# EAGLE design atmega8 (EAGLE 8.0.1)
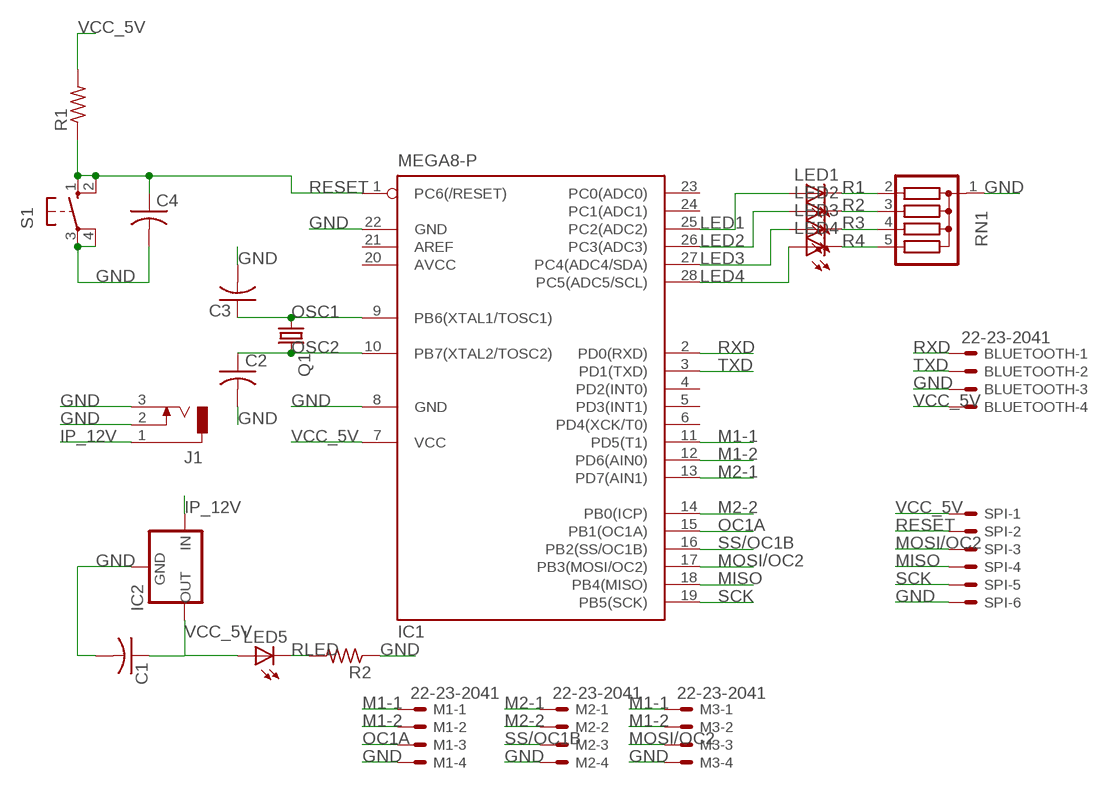
[diagram p0: schematic, sheet 1]

## Parts
BLUETOOTH  22-23-2041  [22-23-2041]
C1  C-US050-025X075  [C050-025X075]
C2  C-US050-025X075  [C050-025X075]
C3  C-US050-025X075  [C050-025X075]
C4  C-US050-025X075  [C050-025X075]
IC1  MEGA8-P  [DIL28-3]
IC2  78XXL  [78XXL]
J1  DCJ0303  [DCJ0303]
LED1  LED3MM  [LED3MM]
LED2  LED3MM  [LED3MM]
LED3  LED3MM  [LED3MM]
LED4  LED3MM  [LED3MM]
LED5  LED3MM  [LED3MM]
M1  22-23-2041  [22-23-2041]
M2  22-23-2041  [22-23-2041]
M3  22-23-2041  [22-23-2041]
Q1  CRYSTALHC18U-V  [HC18U-V]
R1  R-US_0204/7  [0204/7]
R2  R-US_0204/7  [0204/7]
RN1  G04R  [SIL5]
S1  10-XX  [B3F-10XX]
SPI  22-23-2061  [22-23-2061]

## Nets
GND: BLUETOOTH.3 C1.2 C2.2 C3.2 C4.2 IC1.8(GND) IC1.22(GND) IC2.GND J1.2 J1.3 M1.4 M2.4 M3.4 R2.1 RN1.1 S1.3(P) S1.4(P1) SPI.6
IP_12V: IC2.IN J1.1
LED1: IC1.25(PC2(ADC2)) LED1.A
LED2: IC1.26(PC3(ADC3)) LED2.A
LED3: IC1.27(PC4(ADC4/SDA)) LED3.A
LED4: IC1.28(PC5(ADC5/SCL)) LED4.A
M1-1: IC1.11(PD5(T1)) M1.1 M3.1
M1-2: IC1.12(PD6(AIN0)) M1.2 M3.2
M2-1: IC1.13(PD7(AIN1)) M2.1
M2-2: IC1.14(PB0(ICP)) M2.2
MISO: IC1.18(PB4(MISO)) SPI.4
MOSI/OC2: IC1.17(PB3(MOSI/OC2)) M3.3 SPI.3
OC1A: IC1.15(PB1(OC1A)) M1.3
OSC1: C3.1 IC1.9(PB6(XTAL1/TOSC1)) Q1.1
OSC2: C2.1 IC1.10(PB7(XTAL2/TOSC2)) Q1.2
R1: LED1.K(C) RN1.2
R2: LED2.K(C) RN1.3
R3: LED3.K(C) RN1.4
R4: LED4.K(C) RN1.5
RESET: C4.1 IC1.1(PC6(/RESET)) R1.1 S1.1(S) S1.2(S1) SPI.2
RLED: LED5.K(C) R2.2
RXD: BLUETOOTH.1 IC1.2(PD0(RXD))
SCK: IC1.19(PB5(SCK)) SPI.5
SS/OC1B: IC1.16(PB2(SS/OC1B)) M2.3
TXD: BLUETOOTH.2 IC1.3(PD1(TXD))
VCC_5V: BLUETOOTH.4 C1.1 IC1.7(VCC) IC2.OUT LED5.A R1.2 SPI.1
Unconnected: IC1.4(PD2(INT0)) IC1.5(PD3(INT1)) IC1.6(PD4(XCK/T0)) IC1.21(AREF) IC1.23(PC0(ADC0)) IC1.24(PC1(ADC1))

## Power pins joined to a net without a drawn wire
AVCC: IC1.20(AVCC)

## Library data of the parts
BLUETOOTH M1-M3 = con-molex:22-23-2041: .100" (2.54mm) Center Header - 4 Pin; MF: MOLEX; MPN: 22-23-2041; OC_FARNELL: 1462920; OC_NEWARK: 38C0355
C1-C4 = rcl:C-US: CAPACITOR, American symbol
IC1 = atmel:MEGA8-P: MICROCONTROLLER 8 Kbytes FLASH, 1 kbytes SRAM, 512 bytes EEPROM, USART, 4-channel 10 bit ADC, 2-channel 8 bit ADC Pin compatible with Atmega48, ATMega88, ATMega168 Source: avr.lbr; OC_FARNELL: unknown; OC_NEWARK: unknown
IC2 = v-reg:78XXL: VOLTAGE REGULATOR
J1 = con-jack:DCJ0303: DC POWER JACK Source: DCJ0303.pdf; OC_FARNELL: unknown; OC_NEWARK: unknown
LED1-LED5 = led:LED: LED OSRAM: - CHIPLED LG R971, LG N971, LY N971, LG Q971, LY Q971, LO R971, LY R971 LH N974, LH R974 LS Q976, LO Q976, LY Q976 LO Q996 - Hyper CHIPLED LW Q18S LB Q993, LB Q99A, LB R99A - SideLED LS A670, LO A670, LY A670, LG A670, LP A670 LB A673, LV A673, LT A673, LW A673 LH A674 LY A675 LS A676, LA A676, LO A676, LY A676, LW A676 LS A679, LY A679, LG A679 - Hyper Micro SIDELED® LS Y876, LA Y876, LO Y876, LY Y876 LT Y87S - SmartLED LW L88C, LW L88S LB L89C, LB L89S, LG L890 LS L89K, LO L89K, LY L89K LS L896, LA L896, LO L896, LY L896 - TOPLED LS T670, LO T670, LY T670, LG T670, LP T670 LSG T670, LSP T670, LSY T670, LOP T670, LYG T670 LG T671, LOG T671, LSG T671 LB T673, LV T673, LT T673, LW T673 LH T674 LS T676, LA T676, LO T676, LY T676, LB T676, LH T676, LSB T676, LW T676 LB T67C, LV T67C, LT T67C, LS T67K, LO T67K, LY T67K, LW E67C LS E67B, LA E67B, LO E67B, LY E67B, LB E67C, LV E67C, LT E67C LW T67C LS T679, LY T679, LG T679 LS T770, LO T770, LY T770, LG T770, LP T770 LB T773, LV T773, LT T773, LW T773 LH T774 LS E675, LA E675, LY E675, LS T675 LS T776, LA T776, LO T776, LY T776, LB T776 LHGB T686 LT T68C, LB T68C - Hyper Mini TOPLED® LB M676 - Mini TOPLED Santana® LG M470 LS M47K, LO M47K, LY M47K Source: http://www.osram.convergy.de LUXEON: - LUMILED® LXK2-PW12-R00, LXK2-PW12-S00, LXK2-PW14-U00, LXK2-PW14-V00 LXK2-PM12-R00, LXK2-PM12-S00, LXK2-PM14-U00 LXK2-PE12-Q00, LXK2-PE12-R00, LXK2-PE12-S00, LXK2-PE14-T00, LXK2-PE14-U00 LXK2-PB12-K00, LXK2-PB12-L00, LXK2-PB12-M00, LXK2-PB14-N00, LXK2-PB14-P00, LXK2-PB14-Q00 LXK2-PR12-L00, LXK2-PR12-M00, LXK2-PR14-Q00, LXK2-PR14-R00 LXK2-PD12-Q00, LXK2-PD12-R00, LXK2-PD12-S00 LXK2-PH12-R00, LXK2-PH12-S00 LXK2-PL12-P00, LXK2-PL12-Q00, LXK2-PL12-R00 Source: www.luxeon.com KINGBRIGHT: KA-3528ASYC Source: www.kingbright.com
Q1 = crystal:CRYSTAL: CRYSTAL; OC_FARNELL: unknown; OC_NEWARK: unknown
R1 R2 = rcl:R-US_: RESISTOR, American symbol
RN1 = resistor-sil:G04R: SIL RESISTOR; OC_FARNELL: unknown; OC_NEWARK: unknown
S1 = switch-omron:10-XX: OMRON SWITCH; MPN: B3F-1000; OC_FARNELL: 176432; OC_NEWARK: 36M3542
SPI = con-molex:22-23-2061: .100" (2.54mm) Center Header - 6 Pin; MF: MOLEX; MPN: 22-23-2061; OC_FARNELL: 1462922; OC_NEWARK: 27C1933

## Board
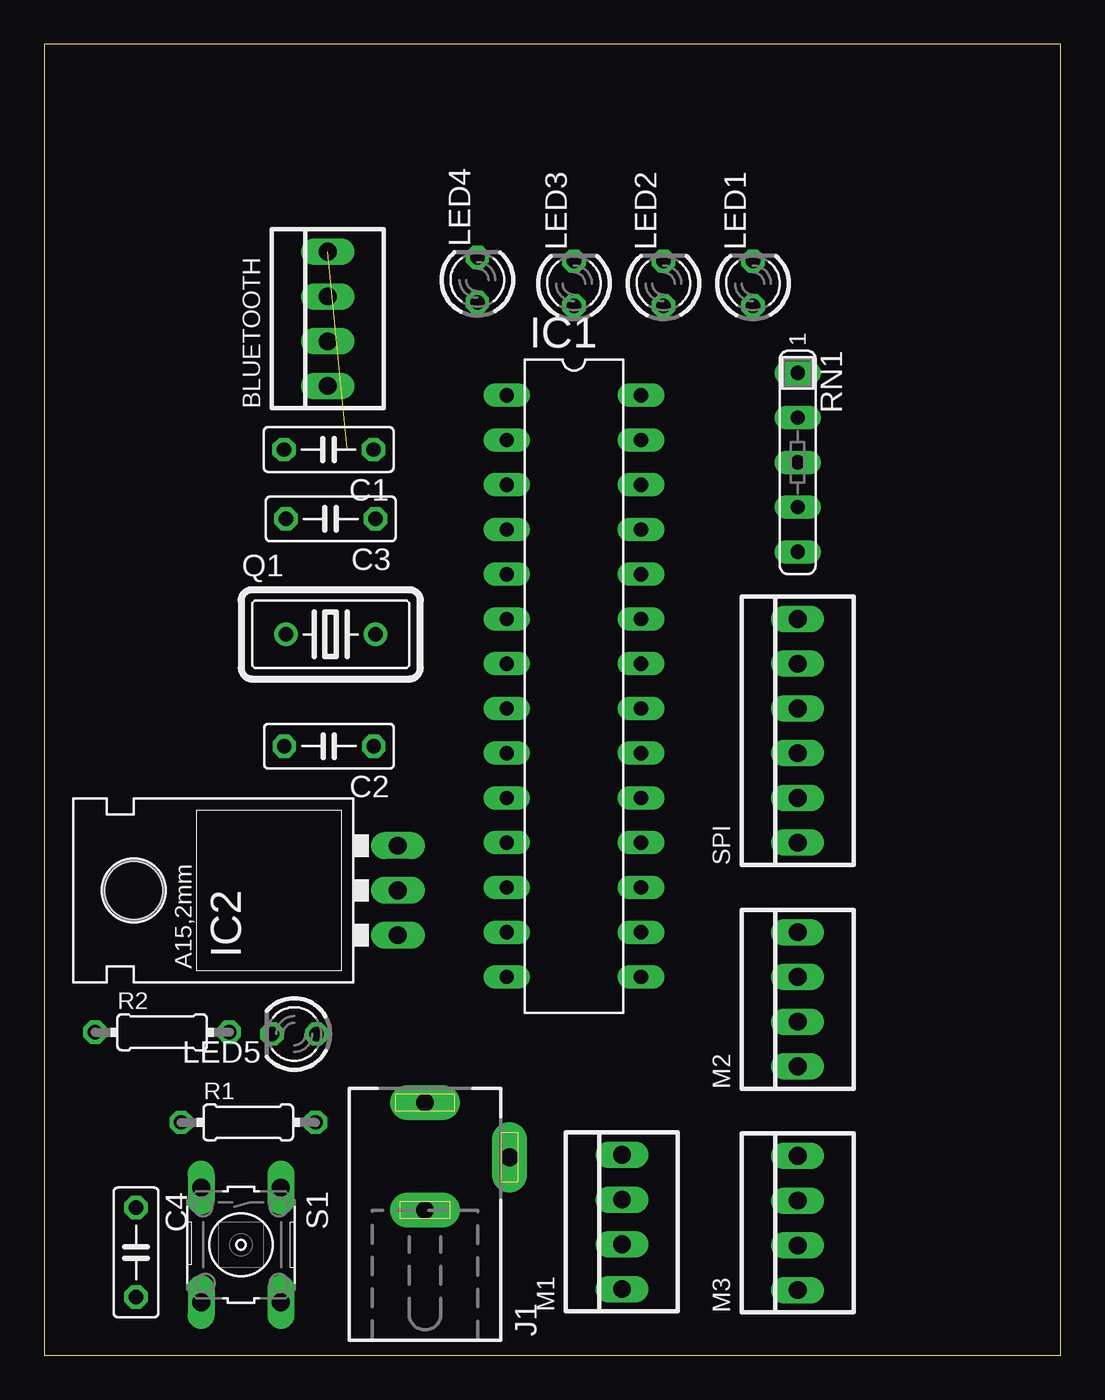
[diagram p1: board, top side]
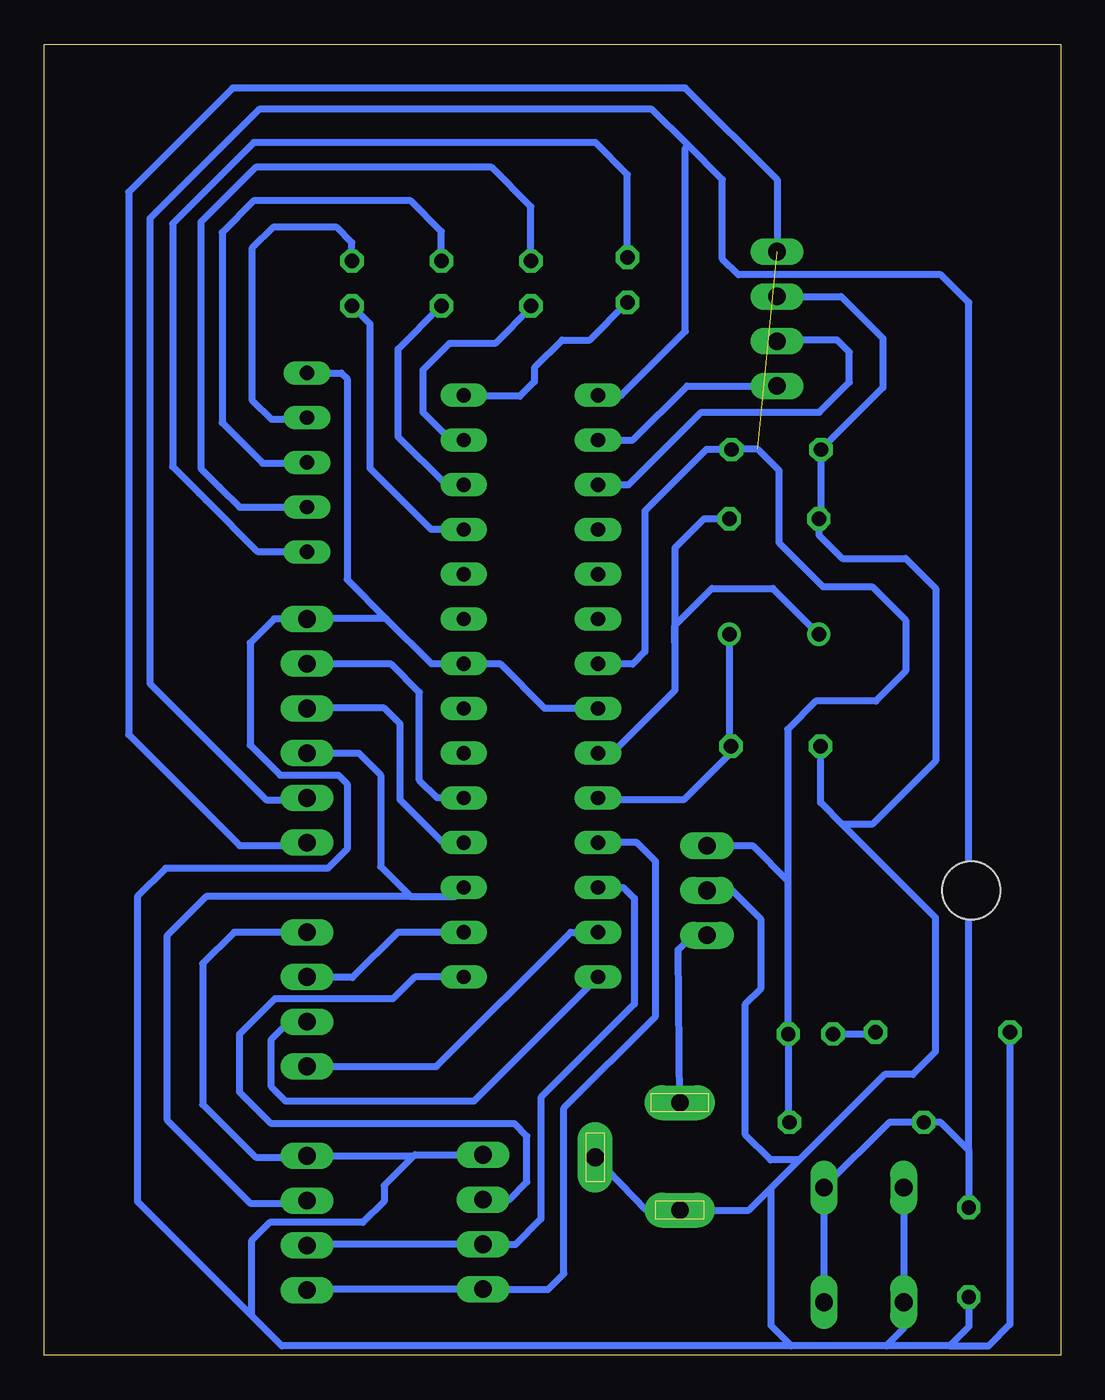
[diagram p2: board, bottom side, seen from below]

Size 57.7 x 74.45 mm. Coordinates in mm from the lower left corner, seen from the top.
Outline: 0,0 57.7,0 57.7,74.45 0,74.45 0,0
Copper layers (1*16): Top 0.035mm / dielectric 1.5mm / Bottom 0.035mm
Design rules "default": minimum track width 10mil, minimum drill 24mil, track to track 8mil, track to pad 8mil, pad to pad 8mil, via to via 8mil, smd to smd 8mil, copper to edge 40mil, drill to drill 8mil, minimum pad ring 10mil, minimum via ring 8mil, stop-mask expansion 4mil, vias tented up to drill 0mil, thermal gap 10mil

### Footprints (pad centres in the part's own frame; a part is rotated, then mirrored left to right if it is on the bottom)
22-23-2041 = drill 1 long: 1 -3.81,0; 2 -1.27,0; 3 1.27,0; 4 3.81,0
C050-025X075 = drill 0.813 octagon: 1 -2.54,0; 2 2.54,0
DIL28-3 = drill 0.813 long: 1 -16.51,-3.81; 2 -13.97,-3.81; 3 -11.43,-3.81; 4 -8.89,-3.81; 5 -6.35,-3.81; 6 -3.81,-3.81; 7 -1.27,-3.81; 8 1.27,-3.81; 9 3.81,-3.81; 10 6.35,-3.81; 11 8.89,-3.81; 12 11.43,-3.81; 13 13.97,-3.81; 14 16.51,-3.81; 15 16.51,3.81; 16 13.97,3.81; 17 11.43,3.81; 18 8.89,3.81; 19 6.35,3.81; 20 3.81,3.81; 21 1.27,3.81; 22 -1.27,3.81; 23 -3.81,3.81; 24 -6.35,3.81; 25 -8.89,3.81; 26 -11.43,3.81; 27 -13.97,3.81; 28 -16.51,3.81
78XXL = drill 1.016 long: GND 0,-3.81; IN -2.54,-3.81; OUT 2.54,-3.81 | hole 3.302: 0,11.176
DCJ0303 = drill 1 pad 2 long: 1 0,3.1; 2 4.8,0; 3 0,-3
LED3MM = drill 0.813 octagon: A -1.27,0; K 1.27,0
HC18U-V = drill 0.813: 1 -2.54,0; 2 2.54,0
0204/7 = drill 0.813 octagon: 1 -3.81,0; 2 3.81,0
SIL5 = drill 0.813 long: 1 -5.08,0; 2 -2.54,0; 3 0,0; 4 2.54,0; 5 5.08,0
B3F-10XX = drill 1.016 long: 1 -3.251,2.261; 2 3.251,2.261; 3 -3.251,-2.261; 4 3.251,-2.261
22-23-2061 = drill 1 long: 1 -6.35,0; 2 -3.81,0; 3 -1.27,0; 4 1.27,0; 5 3.81,0; 6 6.35,0

### Placement (x,y rotation side)
BLUETOOTH  16.1,58.85 90 top
C1  16.15,51.43 180 top
C2  16.17,34.59 180 top
C3  16.27,47.49 180 top
C4  5.22,5.85 270 top
IC1  30.07,38 270 top
IC2  16.27,26.4 90 top
J1  21.62,11.25 0 top
LED1  40.23,60.86 90 top
LED2  35.15,60.86 90 top
LED3  30.07,60.86 90 top
LED4  24.59,61.06 90 top
LED5  14.2,18.25 180 top
M1  32.79,7.58 90 top
M2  42.77,20.22 90 top
M3  42.77,7.52 90 top
Q1  16.27,40.94 0 top
R1  11.59,13.23 0 top
R2  6.7,18.35 0 top
RN1  42.77,50.7 270 top
S1  11.18,6.28 270 top
SPI  42.77,35.46 90 top

### Tracks (layer width: path | path; a pad name or v marks a point on that pad's centre or on a via)
GND
  Bottom 0.406: 38.3,41.85 35.72,39.27 IC1.22 31.82,39.27 29.3,36.75 26.28,36.75 IC1.8 | 38.3,41.85 42.73,41.85 SPI.6 44.64,41.81 46,40.45 46,34.65 44.3,32.95 41,32.95 40.5,32.45 40.5,28.75 41.6,27.65 50.8,27.65 52.4,26.05 52.4,8.75 45.9,2.25 | 5.2,3.29 C4.2 | RN1.1 40.83,55.78 40.5,55.45 40.5,44.05 38.3,41.85 | BLUETOOTH.3 12.47,60.12 10.1,57.75 10.1,54.94 C1.2 13.61,47.61 C3.2 13.73,46.58 12.4,45.25 8.8,45.25 7.1,43.55 7.1,33.75 10.7,30.15 12.3,30.15 12.35,30.1 | 45.9,2.25 45.9,6.55 44.9,7.55 39.6,7.55 38.4,8.75 38.4,9.65 36.66,11.39 | 45.9,2.25 44.2,0.55 15.3,0.55 | S1.3 S1.4 | M2.4 46.92,24.03 48.7,22.25 48.7,14.25 45.7,11.25 42.85,11.25 M3.4 36.72,11.33 36.66,11.39 | C2.2 13.63,31.38 12.35,30.1 | C4.2 5.22,2.53 | S1.4 8.92,2.47 | 12.35,30.1 7.1,24.85 7.1,17.25 8.4,15.95 10,15.95 14.85,11.1 | IC2.GND 18.65,26.4 17,24.75 17,20.85 17.9,19.95 17.9,12.53 16.47,11.1 14.85,11.1 | S1.4 8.92,2.17 | 9.9,0.55 15.3,0.55 | 6.3,0.55 9.9,0.55 | 6.3,0.55 4.1,0.55 2.89,1.76 R2.1 | 15.9,1.15 16.38,1.63 | 15.9,1.15 15.3,0.55 | S1.4 8.92,1.53 9.9,0.55 | C4.2 5.22,1.63 6.3,0.55 | J1.2 23.52,8.25 J1.3 17.7,8.25 16.45,9.5 | 16.45,9.5 14.85,11.1 | 36.66,11.39 M1.4 | 16.45,9.5 16.45,1.7 15.9,1.15
IP_12V
  Bottom 0.406: IC2.IN 20.89,23.86 21.72,23.03 J1.1
LED1
  Bottom 0.406: IC1.25 35.74,46.89 39.2,50.35 39.2,58.56 LED1.A
LED2
  Bottom 0.406: IC1.26 34.88,49.43 37.6,52.15 37.6,57.14 LED2.A
LED3
  Bottom 0.406: IC1.27 34.62,51.97 36.2,53.55 36.2,55.95 34.7,57.45 32.1,57.45 30.07,59.48 LED3.A
LED4
  Bottom 0.406: LED4.A 26.73,57.65 28.3,57.65 29.87,56.08 29.87,55.28 30.7,54.45 33.82,54.45 IC1.28
M1-1
  Bottom 0.406: IC1.11 24.06,29.11 23,28.05 23,19.25 28.2,14.05 28.2,4.65 29.1,3.75 32.77,3.75 M1.1 42.71,3.77 M3.1
M1-2
  Bottom 0.406: 25.22,26.57 IC1.12 24.82,26.57 24.2,25.95 24.2,19.95 29.5,14.65 29.5,7.75 30.94,6.31 M1.2 | 32.73,6.25 M1.2 | M1.2 42.71,6.31 M3.2
M2-1
  Bottom 0.406: IC1.13 27.82,24.03 35.44,16.41 M2.1 42.61,16.25
M2-2
  Bottom 0.406: M2.2 42.97,18.75 44,18.75 44.8,17.95 44.8,15.25 44,14.45 33.3,14.45 IC1.14
MISO
  Bottom 0.406: IC1.18 35.06,29.11 37.5,31.55 37.5,35.85 38.4,36.75 42.75,36.75 SPI.4
MOSI/OC2
  Bottom 0.406: M3.3 42.91,8.65 46,8.65 50.7,13.35 50.7,23.85 48.5,26.05 36.9,26.05 | SPI.3 39.84,34.19 38.6,32.95 38.6,27.75 36.9,26.05 | 36.9,26.05 34.4,26.05 IC1.17
OC1A
  Bottom 0.406: IC1.15 36.66,21.49 37.9,20.25 44.6,20.25 46.6,18.25 46.6,14.95 44.8,13.15 31,13.15 30.3,12.45 30.3,9.85 31.3,8.85 M1.3
OSC1
  Bottom 0.406: IC1.9 25.46,34.19 21.9,37.75 21.9,40.45 | 21.9,40.45 21.9,41.45 19.8,43.55 16.34,43.55 Q1.1 | C3.1 20.26,47.49 21.9,45.85 21.9,40.45
OSC2
  Bottom 0.406: Q1.2 18.81,34.69 C2.1 18.71,34.24 21.4,31.55 26.16,31.55 IC1.10
R1
  Bottom 0.406: LED1.K 40.23,63.18 41.1,64.05 44.7,64.05 45.9,62.85 45.9,54.25 44.8,53.15 42.86,53.15 RN1.2
R2
  Bottom 0.406: LED2.K 35.15,63.8 36.9,65.55 45.8,65.55 47.6,63.75 47.6,52.95 45.3,50.65 42.82,50.65 RN1.3
R3
  Bottom 0.406: LED3.K 30.07,65.22 32.3,67.45 45.7,67.45 48.8,64.35 48.8,50.35 47.75,49.3 | RN1.4 46.6,48.15 47.75,49.3 | 47.75,49.3 48,49.55
R4
  Bottom 0.406: LED4.K 24.59,67.04 26.4,68.85 45.8,68.85 50.4,64.25 50.4,50.45 48.5,48.55 | 48.5,48.55 48.9,48.95 | 48.5,48.55 45.6,45.65 42.8,45.65 RN1.5
RESET
  Bottom 0.406: S1.1 S1.2 | IC1.1 24.94,54.51 21.3,58.15 21.3,68.55 21.15,68.7 | SPI.2 42.87,31.55 45.1,31.55 51.7,38.15 51.7,64.55 45.5,70.75 23.2,70.75 21.15,68.7 | 5.22,11.65 5.22,59.77 6.8,61.35 18.3,61.35 19.2,62.25 19.2,66.75 21.15,68.7 | 5.22,11.65 C4.1 | 13.4,9.57 S1.1 | 5.22,11.65 6.8,13.23 R1.1 9.74,13.23 S1.1
RLED
  Bottom 0.406: LED5.K 10.61,18.25 R2.2
RXD
  Bottom 0.406: BLUETOOTH.1 21.21,55.04 24.28,51.97 IC1.2
SCK
  Bottom 0.406: 42.75,39.25 SPI.5 42.75,39.25 | IC1.19 35.4,31.65 36.4,32.65 36.4,37.65 38,39.25 42.75,39.25
SS/OC1B
  Bottom 0.406: 42.63,21.35 M2.3 42.73,21.45 40.2,21.45 37.62,24.03 IC1.16
TXD
  Bottom 0.406: IC1.3 24.52,49.43 20.4,53.55 13.7,53.55 12,55.25 12,56.95 12.7,57.65 16.03,57.65 BLUETOOTH.2
VCC_5V  (1 unrouted)
  Bottom 0.406: 19.2,51.43 C1.1 | 19.2,51.43 20.12,51.43 23.6,47.95 23.6,39.95 24.3,39.25 26.24,39.25 IC1.7 | BLUETOOTH.4 16.1,66.75 21.3,71.95 47,71.95 52.9,66.05 52.9,35.25 46.6,28.95 42.93,28.95 SPI.1 | 19.2,51.43 19.18,51.45 17.2,51.45 16,50.25 16,46.15 13.5,43.65 10.7,43.65 8.8,41.75 8.8,38.85 10.5,37.15 13.9,37.15 15.5,35.55 15.5,26.95 | IC2.OUT 17.49,28.94 15.5,26.95 | 15.5,26.95 15.5,18.28 LED5.A 15.47,13.3 R1.2